# EAGLE design VRS_V1.4 (EAGLE 9.1.3)
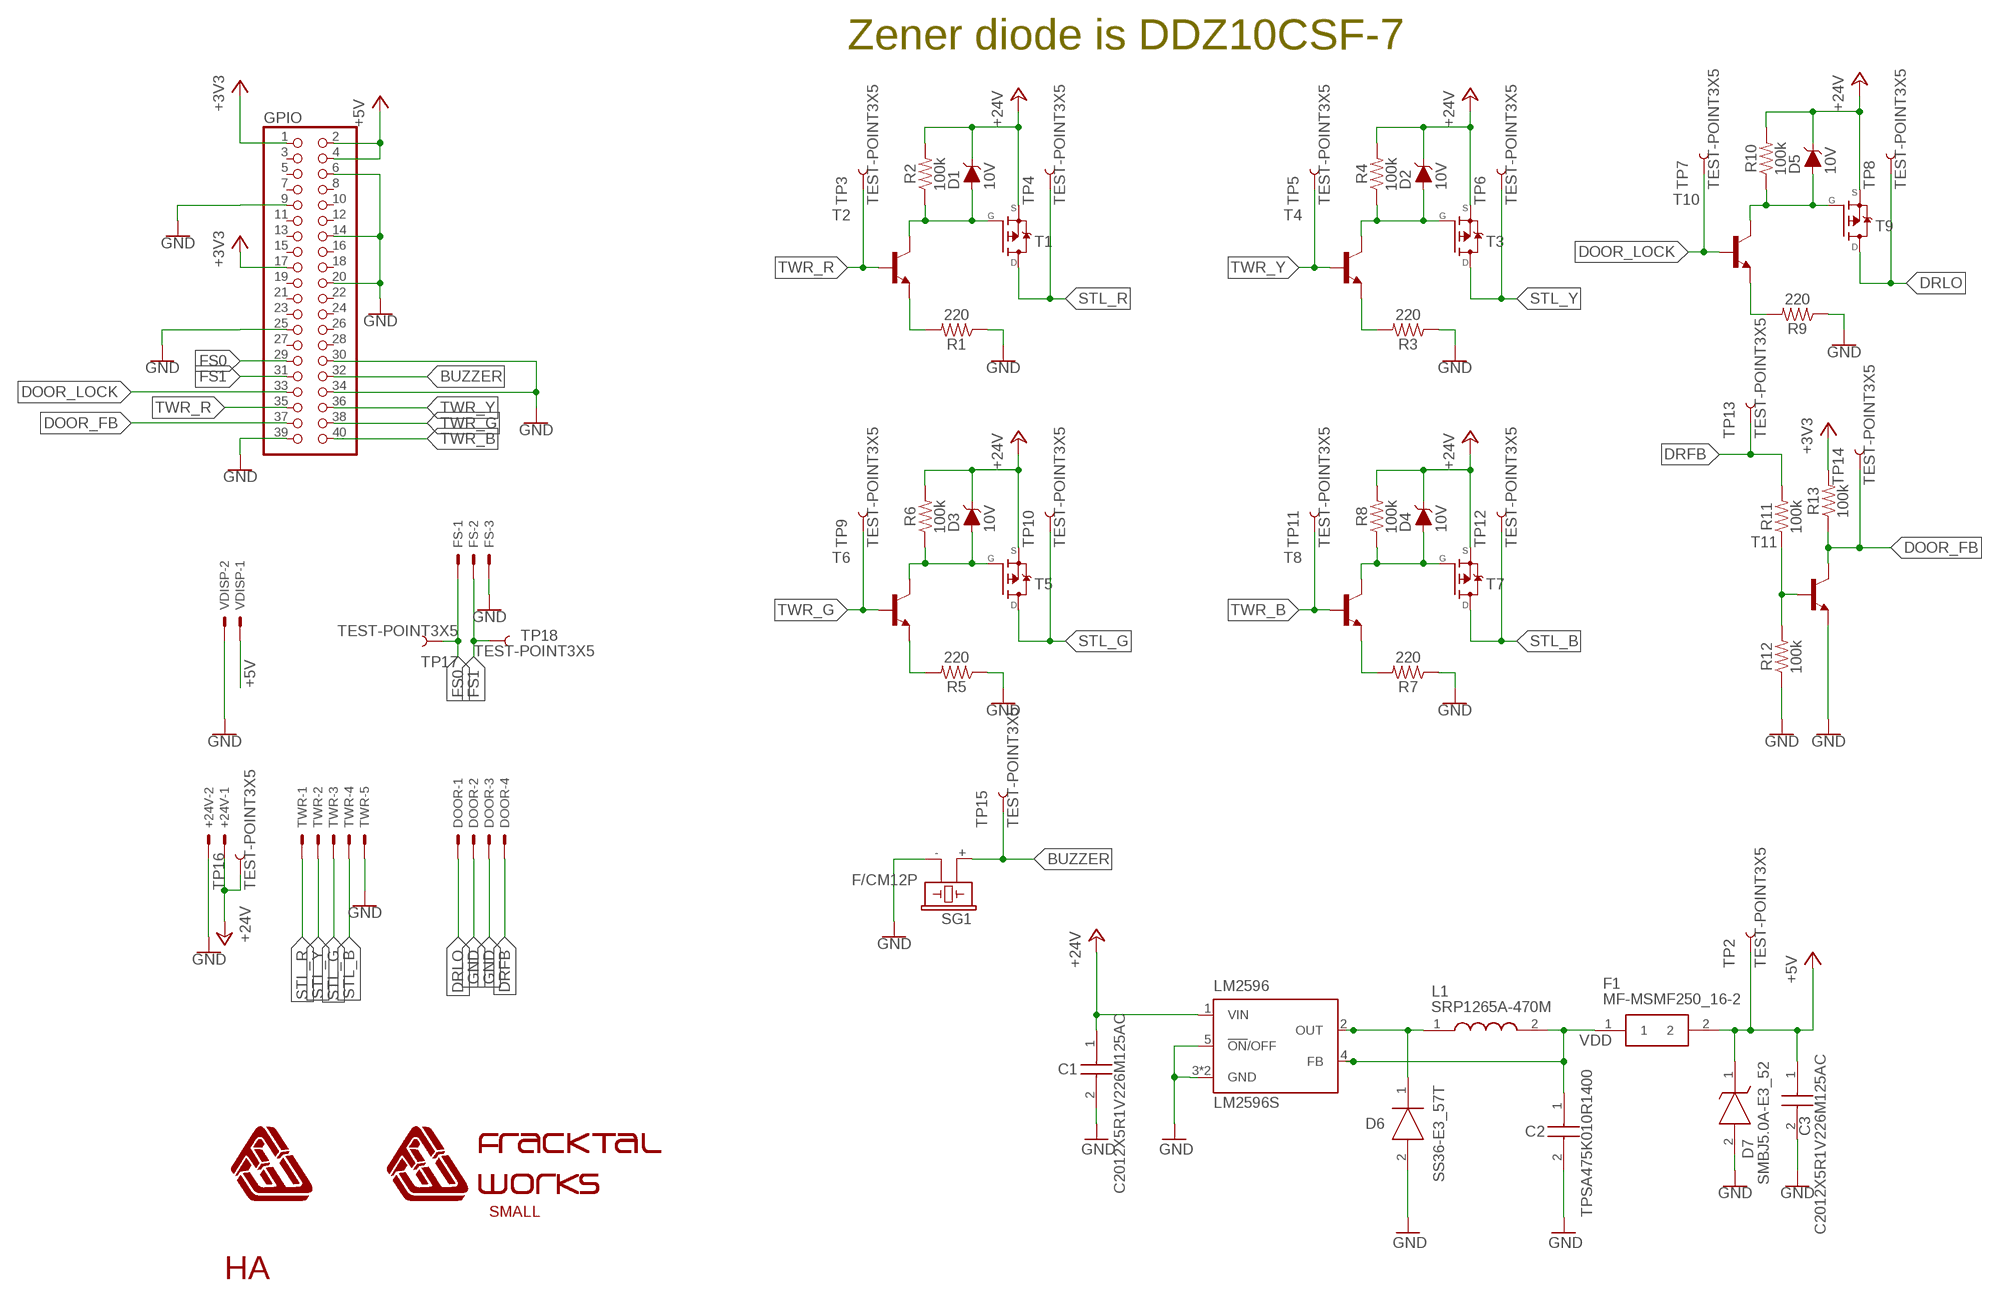
[diagram p0: schematic, sheet 1]

## Parts
+24V  JST-XH-02-PIN-LONG-PAD  [JST-XH-02-PACKAGE-LONG-PAD]
C1  C2012X5R1V226M125AC  [CAPC2012X145N]
C2  TPSA475K010R1400  [CAPPM3216X180N]
C3  C2012X5R1V226M125AC  [CAPC2012X145N]
D1  10V  DIODE-ZENER-DZ2J150M0L  [PANASONIC_SMINI2-F5-B]
D2  10V  DIODE-ZENER-DZ2J150M0L  [PANASONIC_SMINI2-F5-B]
D3  10V  DIODE-ZENER-DZ2J150M0L  [PANASONIC_SMINI2-F5-B]
D4  10V  DIODE-ZENER-DZ2J150M0L  [PANASONIC_SMINI2-F5-B]
D5  10V  DIODE-ZENER-DZ2J150M0L  [PANASONIC_SMINI2-F5-B]
D6  SS36-E3_57T  [DIOM7959X262N]
D7  SMBJ5.0A-E3_52  [DIOM5436X244N]
DOOR  JST-XH-04-PIN-LONG-PAD  [JST-XH-04-PACKAGE-LONG-PAD]
F1  MF-MSMF250_16-2  [FUSC4632X160N]
FS  JST-XH-03-PIN-LONG-PAD  [JST-XH-03-PACKAGE-LONG-PAD]
GPIO  RASPBERRYPI_3B_GPIO  [RASPBERRYPI_3B_GPIO]
L1  SRP1265A-470M  [SRP1265A]
LM2596  LM2596S  [LM2596_TO263-5]
M_HA_1  HA_MARK  [HA_MARK]
R1  220  100KOHM-0603-1/10W-1%  [0603]
R2  100k  100KOHM-0603-1/10W-1%  [0603]
R3  220  100KOHM-0603-1/10W-1%  [0603]
R4  100k  100KOHM-0603-1/10W-1%  [0603]
R5  220  100KOHM-0603-1/10W-1%  [0603]
R6  100k  100KOHM-0603-1/10W-1%  [0603]
R7  220  100KOHM-0603-1/10W-1%  [0603]
R8  100k  100KOHM-0603-1/10W-1%  [0603]
R9  220  100KOHM-0603-1/10W-1%  [0603]
R10  100k  100KOHM-0603-1/10W-1%  [0603]
R11  100k  100KOHM-0603-1/10W-1%  [0603]
R12  100k  100KOHM-0603-1/10W-1%  [0603]
R13  100k  100KOHM-0603-1/10W-1%  [0603]
SG1  F/CM12P  [F/CM12P]
T1  MOSFET_P_SOT223  [MOSFET_SOT223]
T2  MMBT3904LT1-NPN-SOT23-BEC  [SOT23-BEC]
T3  MOSFET_P_SOT223  [MOSFET_SOT223]
T4  MMBT3904LT1-NPN-SOT23-BEC  [SOT23-BEC]
T5  MOSFET_P_SOT223  [MOSFET_SOT223]
T6  MMBT3904LT1-NPN-SOT23-BEC  [SOT23-BEC]
T7  MOSFET_P_SOT223  [MOSFET_SOT223]
T8  MMBT3904LT1-NPN-SOT23-BEC  [SOT23-BEC]
T9  MOSFET_P_SOT223  [MOSFET_SOT223]
T10  MMBT3904LT1-NPN-SOT23-BEC  [SOT23-BEC]
T11  MMBT3904LT1-NPN-SOT23-BEC  [SOT23-BEC]
TP2  TEST-POINT3X5  [PAD.03X.05]
TP3  TEST-POINT3X5  [PAD.03X.05]
TP4  TEST-POINT3X5  [PAD.03X.05]
TP5  TEST-POINT3X5  [PAD.03X.05]
TP6  TEST-POINT3X5  [PAD.03X.05]
TP7  TEST-POINT3X5  [PAD.03X.05]
TP8  TEST-POINT3X5  [PAD.03X.05]
TP9  TEST-POINT3X5  [PAD.03X.05]
TP10  TEST-POINT3X5  [PAD.03X.05]
TP11  TEST-POINT3X5  [PAD.03X.05]
TP12  TEST-POINT3X5  [PAD.03X.05]
TP13  TEST-POINT3X5  [PAD.03X.05]
TP14  TEST-POINT3X5  [PAD.03X.05]
TP15  TEST-POINT3X5  [PAD.03X.05]
TP16  TEST-POINT3X5  [PAD.03X.05]
TP17  TEST-POINT3X5  [PAD.03X.05]
TP18  TEST-POINT3X5  [PAD.03X.05]
TWR  JST-XH-05-PIN-LONG-PAD  [JST-XH-05-PACKAGE-LONG-PAD]
U$1  FWLOGO_TEXT_SMALL  [FWLOGO_TEXT_SMALL]
U$5  FWLOGO  [FWLOGO]
VDISP  JST-XH-02-PIN-LONG-PAD  [JST-XH-02-PACKAGE-LONG-PAD]

## Nets
+3V3: GPIO.1 GPIO.17 R13.2
+5V: C3.1 D7.1(K) F1.2 GPIO.2 GPIO.4 TP2.P$1 VDISP.1
+24V: +24V.1 C1.1 D1.C D2.C D3.C D4.C D5.C LM2596.1(VIN) R2.2 R4.2 R6.2 R8.2 R10.2 T1.3(S) T3.3(S) T5.3(S) T7.3(S) T9.3(S) TP16.P$1
BUZZER: GPIO.32 SG1.+ TP15.P$1
DOOR_FB: GPIO.37 R13.1 T11.C TP14.P$1
DOOR_LOCK: GPIO.33 T10.B TP7.P$1
DRFB: DOOR.4 R11.2 TP13.P$1
DRLO: DOOR.1 T9.2(D) T9.4(D) TP8.P$1
FS0: FS.1 GPIO.29 TP17.P$1
FS1: FS.2 GPIO.31 TP18.P$1
GND: +24V.2 C1.2 C2.2 C3.2 D6.2(A) D7.2(A) DOOR.2 DOOR.3 FS.3 GPIO.6 GPIO.9 GPIO.14 GPIO.20 GPIO.25 GPIO.30 GPIO.34 GPIO.39 LM2596.3(GND) LM2596.5(!ON!/OFF) LM2596.6(GND) R1.1 R3.1 R5.1 R7.1 R9.1 R12.1 SG1.- T11.E TWR.5 VDISP.2
N$1: R1.2 T2.E
N$2: D6.1(K) L1.1 LM2596.2(OUT)
N$3: D2.A R4.1 T3.1(G) T4.C
N$4: D1.A R2.1 T1.1(G) T2.C
N$5: R11.1 R12.2 T11.B
N$8: R3.2 T4.E
N$9: D3.A R6.1 T5.1(G) T6.C
N$10: R5.2 T6.E
N$11: D4.A R8.1 T7.1(G) T8.C
N$12: R7.2 T8.E
N$13: D5.A R10.1 T9.1(G) T10.C
N$14: R9.2 T10.E
STL_B: T7.2(D) T7.4(D) TP12.P$1 TWR.4
STL_G: T5.2(D) T5.4(D) TP10.P$1 TWR.3
STL_R: T1.2(D) T1.4(D) TP4.P$1 TWR.1
STL_Y: T3.2(D) T3.4(D) TP6.P$1 TWR.2
TWR_B: GPIO.40 T8.B TP11.P$1
TWR_G: GPIO.38 T6.B TP9.P$1
TWR_R: GPIO.35 T2.B TP3.P$1
TWR_Y: GPIO.36 T4.B TP5.P$1
VDD: C2.1 F1.1 L1.2 LM2596.4(FB)
Unconnected: GPIO.3 GPIO.5 GPIO.7 GPIO.8 GPIO.10 GPIO.11 GPIO.12 GPIO.13 GPIO.15 GPIO.16 GPIO.18 GPIO.19 GPIO.21 GPIO.22 GPIO.23 GPIO.24 GPIO.26 GPIO.27 GPIO.28

## Notes on the sheet
- Zener diode is DDZ10CSF-7

## Library data of the parts
+24V VDISP = Rembrandt:JST-XH-02-PIN: JST XH Connector 2 Pin Wire to board connector. Pitch: 2,54 mm, (0.100") Number of pins: 2 Created by Rembrandt Electronics www.rembrandtelectronics.com
C1 C3 = SamacSys_Parts:C2012X5R1V226M125AC: TDK 0805 C 22uF Ceramic Multilayer Capacitor, 35 V dc, +85C, X5R Dielectric, +/-20% Source: Datasheet <https://product.tdk.com/info/en/catalog/datasheets/mlcc_commercial_midvoltage_en.pdf>; DESCRIPTION: TDK 0805 C 22uF Ceramic Multilayer Capacitor, 35 V dc, +85C, X5R Dielectric, +/-20%; HEIGHT: 1.45mm; MANUFACTURER_NAME: TDK; MANUFACTURER_PART_NUMBER: C2012X5R1V226M125AC; MOUSER_PART_NUMBER: 810-C2012X5R1V226MAC; MOUSER_PRICE-STOCK: https://www.mouser.com/Search/Refine.aspx?Keyword=810-C2012X5R1V226MAC; RS_PART_NUMBER: 9159334P; RS_PRICE-STOCK: http://uk.rs-online.com/web/p/products/9159334P
C2 = SamacSys_Parts:TPSA475K010R1400: AVX 4.7 Source: Datasheet <http://datasheets.avx.com/TPS.pdf>; ALLIED_NUMBER: 70002395; ALLIED_PRICE-STOCK: http://www.alliedelec.com/avx-tpsa475k010r1400/70002395/; DESCRIPTION: AVX 4.7; HEIGHT: 1.8mm; MANUFACTURER_NAME: AVX; MANUFACTURER_PART_NUMBER: TPSA475K010R1400; MOUSER_PART_NUMBER: 581-TPSA475K010R1400; MOUSER_PRICE-STOCK: https://www.mouser.com/Search/Refine.aspx?Keyword=581-TPSA475K010R1400; RS_PART_NUMBER: 1366129; RS_PRICE-STOCK: http://uk.rs-online.com/web/p/products/1366129
D1-D5 = SparkFun-DiscreteSemi:DIODE-ZENER: Zener Diode A Zener diode allows current to flow from its anode to its cathode like a normal semiconductor diode, but it also permits current to flow in the reverse direction when its "Zener voltage" is reached. - WIkipedia; PROD_ID: DIO-12989; VALUE: 15V
D6 = SamacSys_Parts:SS36-E3_57T: SS36-E3/57T, Schottky Diode, 3A max, 60V, 2-Pin, SMC Source: Datasheet <https://componentsearchengine.com/Datasheets/2/SS36-E3_57T.pdf>; ALLIED_NUMBER: 70217328; ALLIED_PRICE-STOCK: https://www.alliedelec.com/general-semiconductor-vishay-ss36-e3-57t/70217328/; DESCRIPTION: SS36-E3/57T, Schottky Diode, 3A max, 60V, 2-Pin, SMC; HEIGHT: 2.62mm; MANUFACTURER_NAME: Vishay; MANUFACTURER_PART_NUMBER: SS36-E3/57T; MOUSER_PART_NUMBER: 625-SS36-E3; MOUSER_PRICE-STOCK: https://www.mouser.com/Search/Refine.aspx?Keyword=625-SS36-E3; RS_PART_NUMBER: 7000975P; RS_PRICE-STOCK: http://uk.rs-online.com/web/p/products/7000975P
D7 = SamacSys_Parts:SMBJ5.0A-E3_52: Vishay SMBJ5.0A-E3/52, Uni-Directional TVS Diode, 600W, 2-Pin DO-214AA Source: Datasheet <https://www.vishay.com/docs/88392/smbj.pdf>; ALLIED_NUMBER: 70217303; ALLIED_PRICE-STOCK: https://www.alliedelec.com/generalsemiconductor-vishay-smbj5-0a-e3-52/70217303/; DESCRIPTION: Vishay SMBJ5.0A-E3/52, Uni-Directional TVS Diode, 600W, 2-Pin DO-214AA; HEIGHT: 2.44mm; MANUFACTURER_NAME: Vishay; MANUFACTURER_PART_NUMBER: SMBJ5.0A-E3/52; MOUSER_PART_NUMBER: 625-SMBJ5.0A-E3; MOUSER_PRICE-STOCK: https://www.mouser.com/Search/Refine.aspx?Keyword=625-SMBJ5.0A-E3; RS_PART_NUMBER: 1652507; RS_PRICE-STOCK: http://uk.rs-online.com/web/p/products/1652507
DOOR = Rembrandt:JST-XH-04-PIN: JST XH Connector 2 Pin Wire to board connector. Pitch: 2,54 mm, (0.100") Number of pins: 4 Created by Rembrandt Electronics www.rembrandtelectronics.com
F1 = SamacSys_Parts:MF-MSMF250_16-2: BOURNS - MF-MSMF250/16-2 - FUSE, RESETTABLE PTC, 16V, 2.5A, 1812 Source: Datasheet <https://www.bourns.com/pdfs/mfmsmf.pdf>; DESCRIPTION: BOURNS - MF-MSMF250/16-2 - FUSE, RESETTABLE PTC, 16V, 2.5A, 1812; HEIGHT: 1.6mm; MANUFACTURER_NAME: Bourns; MANUFACTURER_PART_NUMBER: MF-MSMF250/16-2; MOUSER_PART_NUMBER: 652-MF-MSMF250/16-2; MOUSER_PRICE-STOCK: https://www.mouser.com/Search/Refine.aspx?Keyword=652-MF-MSMF250%2F16-2; RS_PART_NUMBER: 6478229P; RS_PRICE-STOCK: http://uk.rs-online.com/web/p/products/6478229P
FS = Rembrandt:JST-XH-03-PIN: JST XH Connector 2 Pin Wire to board connector. Pitch: 2,54 mm, (0.100") Number of pins: 3 Created by Rembrandt Electronics www.rembrandtelectronics.com
GPIO = FracktalWorks:RASPBERRYPI_3B_GPIO
L1 = SamacSys_Parts:SRP1265A-470M: Bourns SRP1265A Series Shielded Wire-wound SMD Inductor with a Carbonyl Powder Core, 47 uH 20% 6.5A Idc Source: Datasheet <https://www.bourns.com/docs/Product-Datasheets/SRP1265A.pdf>; DESCRIPTION: Bourns SRP1265A Series Shielded Wire-wound SMD Inductor with a Carbonyl Powder Core, 47 uH 20% 6.5A Idc; HEIGHT: mm; MANUFACTURER_NAME: Bourns; MANUFACTURER_PART_NUMBER: SRP1265A-470M; MOUSER_PART_NUMBER: 652-SRP1265A-470M; MOUSER_PRICE-STOCK: https://www.mouser.com/Search/Refine.aspx?Keyword=652-SRP1265A-470M; RS_PART_NUMBER: 8193513P; RS_PRICE-STOCK: http://uk.rs-online.com/web/p/products/8193513P
LM2596 = FracktalWorks:LM2596: SIMPLE SWITCHER® Power Converter 150 kHz 3A Step-Down Voltage Regulator Source: http://www.national.com/ds/LM/LM2596.pdf; MF: NATIONAL SEMICONDUCTOR; MPN: LM2596S-ADJ/NOPB; OC_FARNELL: 9494367; OC_NEWARK: 41K3842
M_HA_1 = FracktalWorks:HA_MARK: Maker mark
R1 R3 R5 R7 R9 = SparkFun-Resistors:100KOHM: 100kΩ resistor A resistor is a passive two-terminal electrical component that implements electrical resistance as a circuit element. Resistors act to reduce current flow, and, at the same time, act to lower voltage levels within circuits. - Wikipedia; PROD_ID: RES-07828; VALUE: 100k
R2 R4 R6 R8 R10-R13 = SparkFun-Resistors:100KOHM: 100kΩ resistor A resistor is a passive two-terminal electrical component that implements electrical resistance as a circuit element. Resistors act to reduce current flow, and, at the same time, act to lower voltage levels within circuits. - Wikipedia; PROD_ID: RES-07828
SG1 = buzzer:F/CM12P: BUZZER Source: Buerklin; OC_FARNELL: unknown; OC_NEWARK: unknown
T1 T3 T5 T7 T9 = FracktalWorks:MOSFET_P_SOT223: MOSFET P channel SOT-223 device
T2 T4 T6 T8 T10 T11 = transistor:*-NPN-: NPN Transistror BF959 corrected 2008.03.06
TP2-TP18 = SparkFun-Connectors:TEST-POINT: SparkFun Test Points Bare copper test points for troubleshooting or In-Circuit-Testing. These are used by our Production team for verifying production board runs using pogo-pins on test beds. SparkFun Products: SparkFun LSM9DS1 Breakout <https://www.sparkfun.com/products/13284> SparkFun PSOC <https://www.sparkfun.com/products/13714> SparkFun Load Cell Amplifier <https://www.sparkfun.com/products/13879>
TWR = Rembrandt:JST-XH-05-PIN: JST XH Connector 2 Pin Wire to board connector. Pitch: 2,54 mm, (0.100") Number of pins: 5 Created by Rembrandt Electronics www.rembrandtelectronics.com
U$1 = FracktalWorks:FWLOGO_TEXT_SMALL
U$5 = FracktalWorks:FWLOGO: Fracktal Works Logo without name

## Board
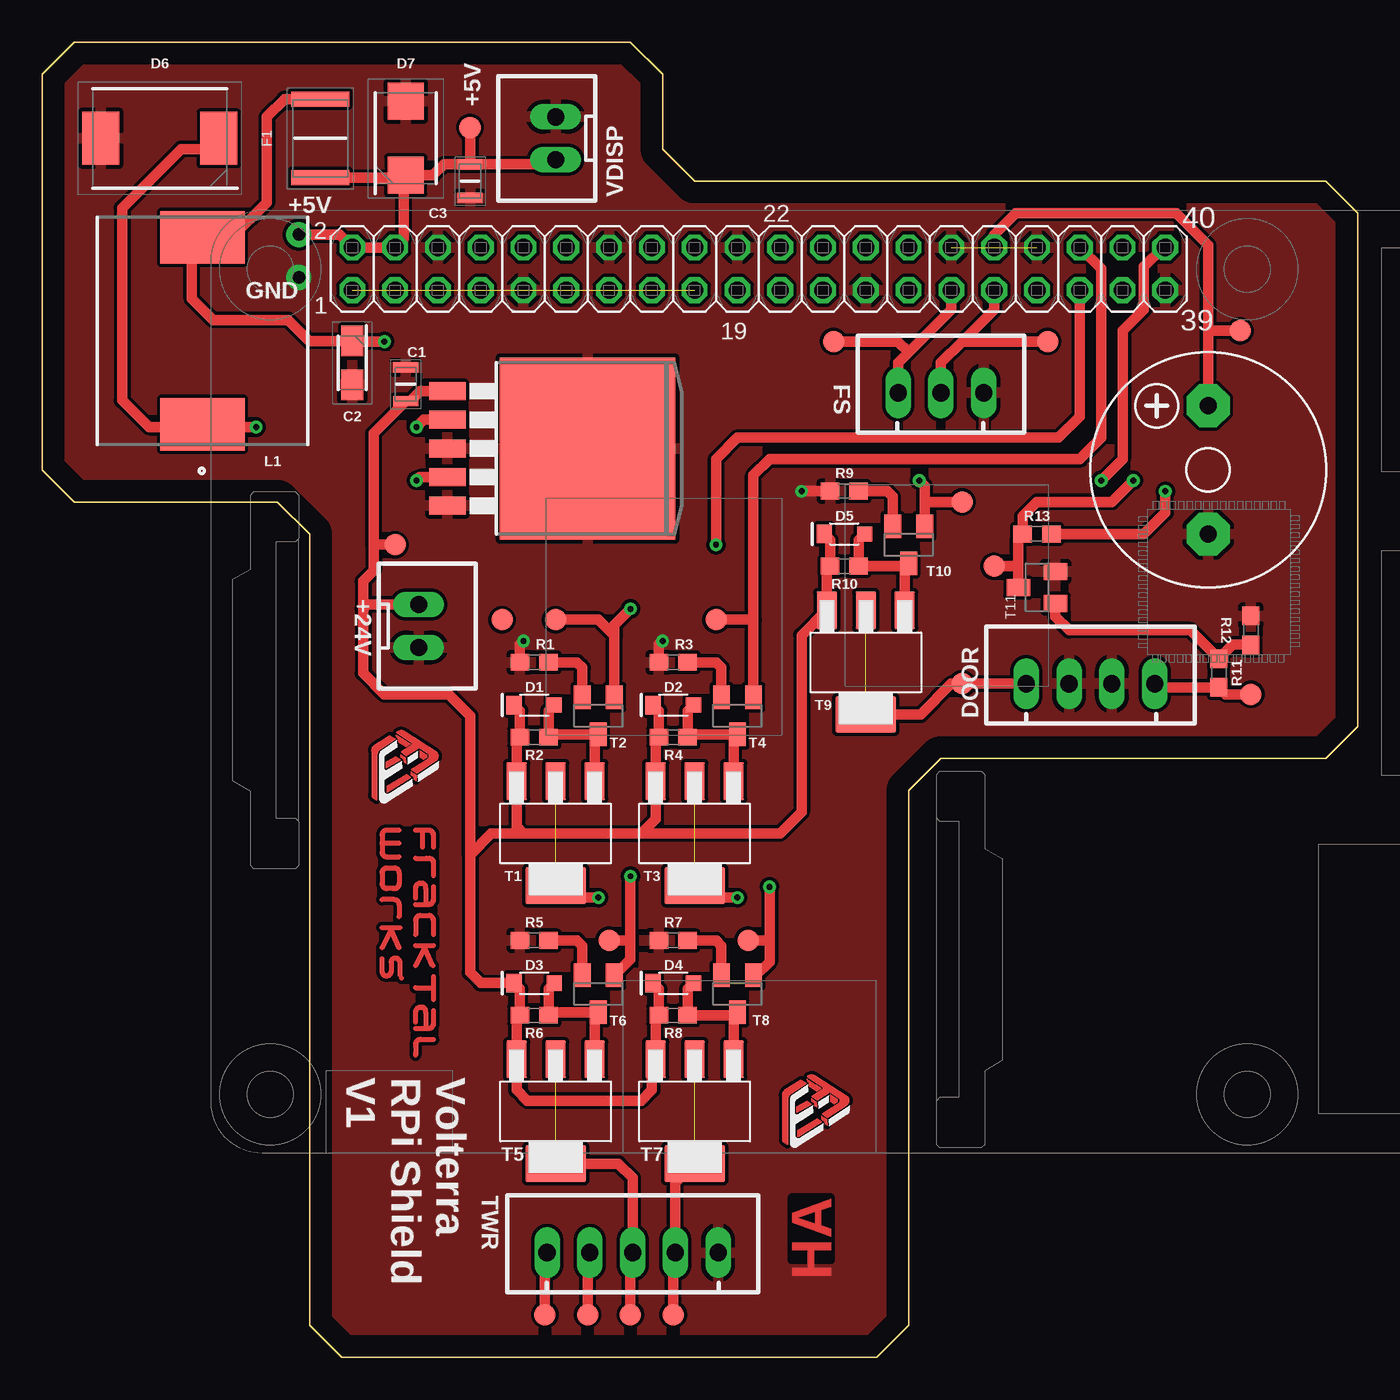
[diagram p1: board, top side]
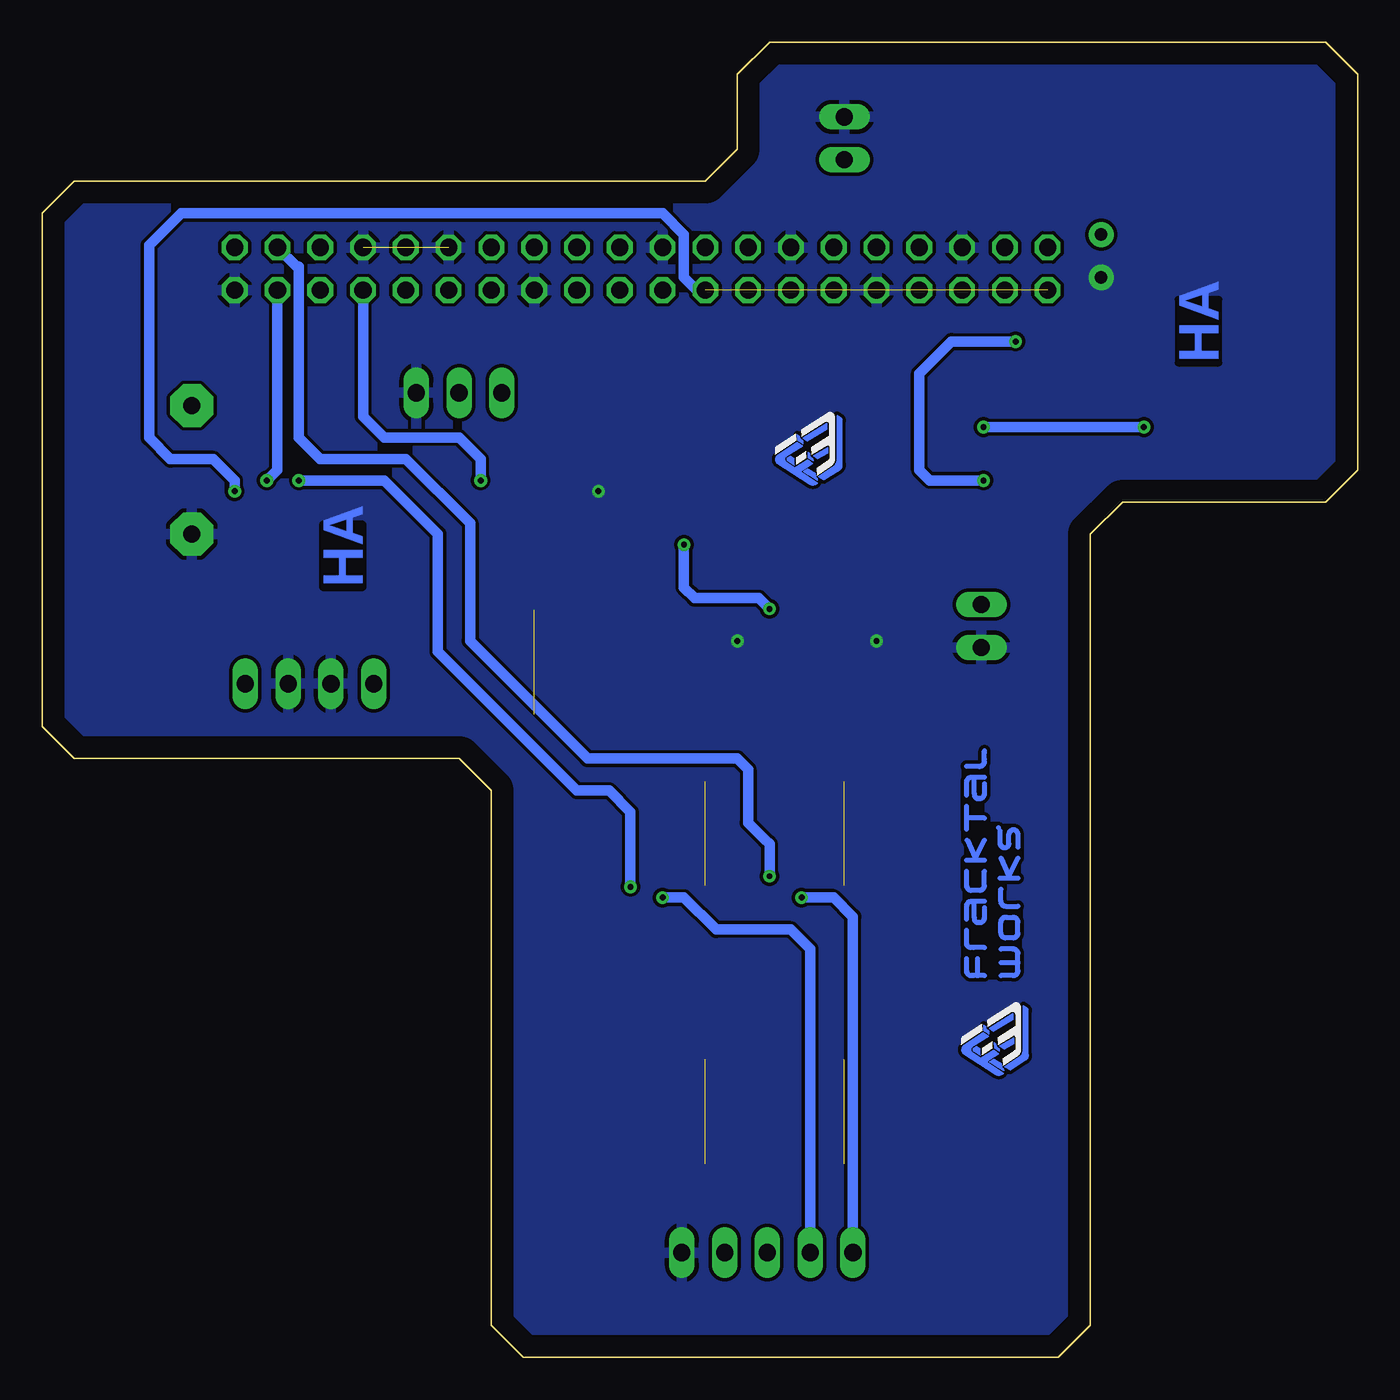
[diagram p2: board, bottom side, seen from below]

Size 78.1 x 78.11 mm. Coordinates in mm from the lower left corner, seen from the top.
Outline: 51.44,1.91 51.44,33.66 53.34,35.56 76.2,35.56 78.1,37.47 78.1,67.95 76.2,69.85 38.73,69.85 36.83,71.75 36.83,76.2 34.92,78.11 1.91,78.11 0,76.2 0,52.7 1.91,50.8 13.97,50.8 15.88,48.89 15.88,1.91 17.78,0 49.53,0 51.44,1.91
Copper layers (1*16): Top 0.035mm / dielectric 1.5mm / Bottom 0.035mm
Design rules "LionCircuits": minimum track width 8mil, minimum drill 0.35mm, track to track 8mil, track to pad 8mil, pad to pad 8mil, via to via 8mil, smd to smd 8mil, copper to edge 50mil, drill to drill 10mil, minimum pad ring 10mil, minimum via ring 8mil, stop-mask expansion 4mil, vias tented up to drill 0mil, thermal gap 10mil

### Footprints (pad centres in the part's own frame; a part is rotated, then mirrored left to right if it is on the bottom)
JST-XH-02-PACKAGE-LONG-PAD = drill 1.016 long: 1 -1.27,0; 2 1.27,0
CAPC2012X145N = smd 0.62 x 1.47: 1 -1,0; 2 1,0
CAPPM3216X180N = smd 1.8 x 1.3: 1 -1.3,0; 2 1.3,0
PANASONIC_SMINI2-F5-B = smd 0.9 x 0.9: A 1.2,0 | smd 0.9 x 1.1: C -1.2,0
DIOM7959X262N = smd 2.2 x 3.15: 1 -3.5,0; 2 3.5,0
DIOM5436X244N = smd 2.2 x 2.15: 1 -2.2,0; 2 2.2,0
JST-XH-04-PACKAGE-LONG-PAD = drill 1.016 long: 1 -3.81,0; 2 -1.27,0; 3 1.27,0; 4 3.81,0
FUSC4632X160N = smd 0.89 x 3.43: 1 -2.325,0; 2 2.325,0
JST-XH-03-PACKAGE-LONG-PAD = drill 1.016 long: 1 -2.54,0; 2 0,0; 3 2.54,0
RASPBERRYPI_3B_GPIO = drill 1.016 octagon: 1 -24.13,-1.27; 2 -24.13,1.27; 3 -21.59,-1.27; 4 -21.59,1.27; 5 -19.05,-1.27; 6 -19.05,1.27; 7 -16.51,-1.27; 8 -16.51,1.27; 9 -13.97,-1.27; 10 -13.97,1.27; 11 -11.43,-1.27; 12 -11.43,1.27; 13 -8.89,-1.27; 14 -8.89,1.27; 15 -6.35,-1.27; 16 -6.35,1.27; 17 -3.81,-1.27; 18 -3.81,1.27; 19 -1.27,-1.27; 20 -1.27,1.27; 21 1.27,-1.27; 22 1.27,1.27; 23 3.81,-1.27; 24 3.81,1.27; 25 6.35,-1.27; 26 6.35,1.27; 27 8.89,-1.27; 28 8.89,1.27; 29 11.43,-1.27; 30 11.43,1.27; 31 13.97,-1.27; 32 13.97,1.27; 33 16.51,-1.27; 34 16.51,1.27; 35 19.05,-1.27; 36 19.05,1.27; 37 21.59,-1.27; 38 21.59,1.27; 39 24.13,-1.27; 40 24.13,1.27
SRP1265A = smd 3.1 x 5: 1 -5.55,0; 2 5.55,0
LM2596_TO263-5 = smd 1.067 x 2.159: 1 -3.404,-5.791; 2 -1.702,-5.791; 3 0,-5.791; 4 1.702,-5.791; 5 3.404,-5.791 | smd 10.8 x 10.41: 6 0,2.54
0603 = smd 1.1 x 1: 1 -0.85,0; 2 0.85,0
F/CM12P = drill 1.016 pad 2.54 octagon: + 3.81,0; - -3.81,0
MOSFET_SOT223 = smd 2.235 x 1.219: 1 -3.099,2.311; 2 -3.099,0; 3 -3.099,-2.311 | smd 2.2 x 3.6: 4 3.099,0
SOT23-BEC = smd 1 x 1.4: B -0.95,-1.1; C 0,1.1; E 0.95,-1.1
PAD.03X.05 = smd 1.27 x 1.27: P$1 0,0
JST-XH-05-PACKAGE-LONG-PAD = drill 1.016 long: 1 -5.08,0; 2 -2.54,0; 3 0,0; 4 2.54,0; 5 5.08,0

### Placement (x,y rotation side)
+24V  22.35,43.43 270 top
C1  21.59,57.78 90 top
C2  18.41,59.06 270 top
C3  25.4,69.85 270 top
D1  29.21,38.73 0 top
D2  37.47,38.73 0 top
D3  29.21,22.23 0 top
D4  37.47,22.23 0 top
D5  47.62,48.89 0 top
D6  6.99,72.39 180 top
D7  21.59,72.39 90 top
DOOR  62.23,40 0 top
F1  16.51,72.39 270 top
FS  53.35,57.28 0 top
GPIO  42.55,64.64 0 top
L1  9.53,60.96 90 top
LM2596  29.84,53.97 270 top
M_HA_1  44.45,9.53 270 top
M_HA_2  HA_MARK  [HA_MARK]  59.05,45.72 90 bottom
M_HA_3  HA_MARK  [HA_MARK]  8.26,59.06 90 bottom
R1  29.21,41.28 0 top
R2  29.21,36.83 180 top
R3  37.47,41.28 0 top
R4  37.47,36.83 180 top
R5  29.21,24.77 0 top
R6  29.21,20.32 180 top
R7  37.47,24.77 0 top
R8  37.47,20.32 180 top
R9  47.62,51.44 0 top
R10  47.62,46.99 180 top
R11  69.85,40.64 270 top
R12  71.75,43.18 270 top
R13  59.05,48.89 0 top
SG1  69.22,52.7 90 top
T1  30.48,31.12 270 top
T2  33.02,38.1 180 top
T3  38.73,31.12 270 top
T4  41.27,38.1 180 top
T5  30.48,14.61 270 top
T6  33.02,21.59 180 top
T7  38.73,14.61 270 top
T8  41.27,21.59 180 top
T9  48.9,41.28 270 top
T10  51.44,48.26 180 top
T11  59.05,45.72 90 top
TP1  TEST-POINT3X5  [PAD.03X.05]  27.3,43.81 0 top
TP2  25.4,73.03 0 top
TP3  30.48,43.81 0 top
TP4  29.84,2.54 0 top
TP5  40.01,43.81 0 top
TP6  32.39,2.54 0 top
TP7  54.61,50.8 0 top
TP8  54.61,40 0 top
TP9  33.66,24.77 0 top
TP10  34.92,2.54 0 top
TP11  41.91,24.77 0 top
TP12  37.47,2.54 0 top
TP13  71.75,39.37 0 top
TP14  56.52,46.99 0 top
TP15  71.12,60.96 0 top
TP16  20.96,48.26 0 top
TP17  46.99,60.33 0 top
TP18  59.69,60.33 0 top
TWR  35.05,6.22 0 top
U$1  18.41,37.47 270 top
U$2  FWLOGO_TEXT_SMALL  [FWLOGO_TEXT_SMALL]  18.41,16.51 90 bottom
U$3  FWLOGO  [FWLOGO]  29.46,50.29 90 bottom
U$5  42.8,18.29 270 top
VDISP  30.48,72.39 90 top

### Tracks (layer width: path | path; a pad name or v marks a point on that pad's centre or on a via)
+3V3  (via drill 0.35)  (1 unrouted)
  Top 0.61: R13.2 65.41,48.89 66.67,50.17 v66.67,51.44
  Bottom 0.61: v66.67,51.44 66.67,52.07 67.94,53.34 70.49,53.34 71.75,54.61 71.75,66.04 69.85,67.95 41.27,67.95 40.01,66.67 40.01,64.14 39.24,63.37 GPIO.17
+5V  (via drill 0.75 pad 1.5)
  Top 0.61: 21.46,70.06 D7.1 | TP2.P$1 25.4,72.39 C3.1 | C3.1 30.21,70.85 VDISP.1 | v15.24,66.67 17.65,66.67 GPIO.2 GPIO.4 21.46,66.42 21.46,70.06 | F1.2 21.46,70.06 | 21.46,70.06 D7.1 | D7.1 23.2,70.19 23.86,70.85 C3.1
+24V
  Top 0.61: D1.C 28.36,38.39 R2.2 28.17,36.64 T1.3 28.17,31.52 28.57,31.12 | D2.C 36.62,38.39 R4.2 36.42,36.64 T3.3 36.42,31.98 35.56,31.12 | D4.C 36.62,21.88 R8.2 36.42,20.13 T7.3 36.2,17.48 36.2,15.88 35.56,15.24 28.8,15.24 28.17,15.88 T5.3 28.17,20.13 R6.2 28.36,21.88 D3.C 26.04,22.23 25.4,22.86 25.4,29.84 | D5.C 46.77,48.55 R10.2 46.58,46.8 T9.3 45.09,42.88 45.09,32.39 43.81,31.12 35.56,31.12 | 25.4,29.84 26.67,31.12 28.57,31.12 | 28.57,31.12 35.56,31.12 | 19.69,48.26 19.69,46.74 19.05,46.1 19.05,44.45 | 19.69,48.26 19.69,54.88 C1.1 21.86,56.78 22.45,57.38 LM2596.1 | 25.4,29.84 25.4,38.1 24.13,39.37 20.32,39.37 19.05,40.64 19.05,44.45 | TP16.P$1 19.69,48.26 | +24V.1 19.3,44.7 19.05,44.45
BUZZER
  Top 0.61: SG1.+ 69.22,60.96 | 69.22,60.96 69.22,66.04 67.31,67.95 57.79,67.95 56.52,66.67 GPIO.32 | TP15.P$1 69.22,60.96
DOOR_FB  (via drill 0.35)
  Top 0.61: T11.C 57.95,46.99 | 57.95,46.99 57.95,48.64 R13.1 58.2,49.95 59.05,50.8 63.5,50.8 v64.77,52.07 | TP14.P$1 57.95,46.99
  Bottom 0.61: v64.77,52.07 64.13,52.7 GPIO.37
DOOR_LOCK  (via drill 0.35)
  Top 0.61: T10.B 52.38,50.8 | 52.38,50.8 52.38,51.75 v52.07,52.07 | TP7.P$1 52.38,50.8
  Bottom 0.61: GPIO.33 59.05,61.59 59.05,55.88 57.79,54.61 53.34,54.61 52.07,53.34 v52.07,52.07
DRFB
  Top 0.61: TP13.P$1 70.27,39.37 R11.2 66.25,39.79 DOOR.4
DRLO  (1 unrouted)
  Top 0.61: 49.61,37.47 T9.4 52.15,38.18 53.98,40 TP8.P$1 DOOR.1
FS0
  Top 0.61: FS.1 50.81,59.07 51.44,59.69 | GPIO.29 53.98,62.23 51.44,59.69 | TP17.P$1 50.8,60.33 51.44,59.69
FS1
  Top 0.61: FS.2 53.35,59.07 54.61,60.33 | GPIO.31 56.52,62.23 54.61,60.33 | TP18.P$1 54.61,60.33
GND  (via drill 0.35, 0.75 pad 1.5)  (1 unrouted)
  Top 0.61: R1.1 28.36,42.33 v28.57,42.55 | R3.1 36.62,42.33 v36.83,42.55 | R9.1 v45.09,51.44
  other vias: 15.24,64.14
  pour Top: -1.27,78.74 -1.27,-1.91 80.01,-1.91 80.01,79.38 -0.63,79.38
  pour Bottom: 0,78.74 0,-0.63 78.74,-0.63 78.74,78.74
N$1
  Top 0.61: T2.E 32.07,40.95 31.75,41.28 R1.2
N$2  (via drill 0.35)
  Top 0.61: LM2596.2 22.66,55.68 v22.23,55.25 | v12.7,55.25 9.69,55.25 | 9.69,55.25 L1.1 | 9.69,55.25 6.35,55.25 4.75,56.84 4.75,68.25 8.26,71.75 9.85,71.75 D6.1
  Bottom 0.61: v22.23,55.25 v12.7,55.25
N$3
  Top 0.61: D2.A 38.31,38.39 R4.1 38.48,37 T4.C 41.05,36.77 T3.1
N$4
  Top 0.61: D1.A 30.06,38.39 R2.1 30.23,37 T2.C 32.79,36.77 T1.1
N$5
  Top 0.61: T11.B 60.16,43.98 60.96,43.18 68.16,43.18 R11.1 70.69,42.33 R12.2
N$8
  Top 0.61: T4.E 40.33,40.95 40.01,41.28 R3.2
N$9
  Top 0.61: D3.A 30.06,21.88 R6.1 30.23,20.49 T6.C 32.79,20.26 T5.1
N$10
  Top 0.61: T6.E 32.07,24.45 31.75,24.77 R5.2
N$11
  Top 0.61: D4.A 38.31,21.88 R8.1 41.27,20.32 | 41.27,20.32 T8.C | T7.1 41.05,20.09 41.27,20.32
N$12
  Top 0.61: T8.E 40.33,24.45 40.01,24.77 R7.2
N$13
  Top 0.61: D5.A 48.48,48.55 R10.1 51.27,46.99 T10.C 51.21,46.93 T9.1
N$14
  Top 0.61: T10.E 50.48,51.11 50.16,51.44 R9.2
STL_B  (1 unrouted)
  Top 0.61: 38.73,10.79 T7.4 37.59,10.36 TWR.4 37.47,6.1 TP12.P$1
STL_G  (1 unrouted)
  Top 0.61: TP10.P$1 34.92,6.1 TWR.3 35.05,10.67 34.21,11.51 T5.4
STL_R  (via drill 0.35)  (1 unrouted)
  Top 0.61: T1.4 31.19,27.3 v33.02,27.3 | TP4.P$1 29.84,6.1 TWR.1
  Bottom 0.61: v33.02,27.3 31.12,27.3 29.97,26.16 TWR.1
STL_Y  (via drill 0.35)  (1 unrouted)
  Top 0.61: T3.4 39.45,27.3 v41.27,27.3 | TP6.P$1 32.39,6.1 TWR.2
  Bottom 0.61: v41.27,27.3 40.01,27.3 38.1,25.4 33.66,25.4 32.51,24.26 TWR.2
TWR_B  (via drill 0.35)
  Top 0.61: GPIO.40 66.55,65.91 65.41,64.77 65.41,62.23 64.13,60.96 64.13,53.34 v62.87,52.07 | v43.18,27.94 43.18,24.77 | 43.18,24.77 43.18,23.5 42.38,22.69 T8.B | TP11.P$1 43.18,24.77
  Bottom 0.61: v62.87,52.07 57.79,52.07 54.61,48.89 54.61,41.91 46.35,33.66 44.45,33.66 43.18,32.39 v43.18,27.94
TWR_G  (via drill 0.35)
  Top 0.61: T6.B 34.92,23.64 34.92,24.77 | 34.92,24.77 v34.92,28.58 | TP9.P$1 34.92,24.77
  Bottom 0.61: GPIO.38 62.99,64.77 62.87,64.77 62.87,54.61 61.59,53.34 56.52,53.34 52.7,49.53 52.7,42.55 45.72,35.56 36.83,35.56 36.2,34.92 36.2,31.75 35.24,30.8 34.92,30.48 v34.92,28.58
TWR_R  (via drill 0.35)
  Top 0.61: T2.B 33.97,42.86 | 33.97,42.86 33.02,43.81 TP3.P$1 | GPIO.35 61.59,55.88 60.33,54.61 41.27,54.61 40.01,53.34 v40.01,48.26 | v34.92,44.45 33.97,43.5 33.97,42.86
  Bottom 0.61: v40.01,48.26 40.01,45.72 39.37,45.09 35.56,45.09 v34.92,44.45
TWR_Y
  Top 0.61: GPIO.36 62.87,64.64 62.87,54.61 61.59,53.34 43.18,53.34 42.23,52.39 42.23,43.81 | T4.B 42.23,43.81 | TP5.P$1 42.23,43.81
VDD  (via drill 0.35)
  Top 0.61: LM2596.4 22.43,52.27 v22.23,52.07 | v20.32,60.33 18.45,60.33 C2.1 15.85,60.36 14.61,61.59 10.16,61.59 8.89,62.86 8.89,65.88 L1.2 11.27,66.51 13.34,68.58 13.34,73.66 14.39,74.72 F1.1
  Bottom 0.61: v20.32,60.33 24.13,60.33 26.04,58.42 26.04,52.7 25.4,52.07 v22.23,52.07

### Text on the board
tPlace: Volterra / RPi Shield / V1
tNames: +5V | +5V | 22 | 2 | 40 | GND | 1 | 19 | 39